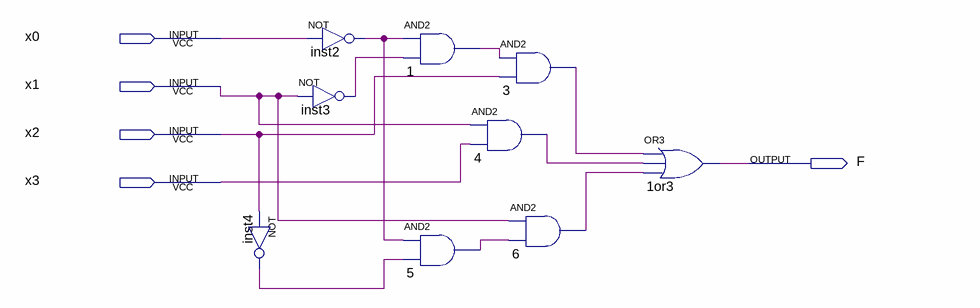
[diagram p0: schematic sheet]
// Quartus schematic lab2block2.bdf as structural Verilog: 9 symbols, 5 pins
module lab2block2 (
  input  x0,
  input  x1,
  input  x2,
  input  x3,
  output F
);

  wire inst2_out, inst3_out, inst4_out, n1_out, n3_out, n4_out, n5_out, n6_out;

  not inst3 (inst3_out, x1);
  not inst4 (inst4_out, x2);
  not inst2 (inst2_out, x0);
  and u_1 (n1_out, inst2_out, inst3_out);
  and u_5 (n5_out, inst2_out, inst4_out);
  and u_3 (n3_out, n1_out, x2);
  and u_4 (n4_out, x1, x3);
  and u_6 (n6_out, x1, n5_out);
  or u_1or3 (F, n3_out, n4_out, n6_out);
endmodule
